# Altium schematic sheet ADCS Subsystem_AVR.SchDoc
size A1; SheetNumber: 1; SheetTotal: 1
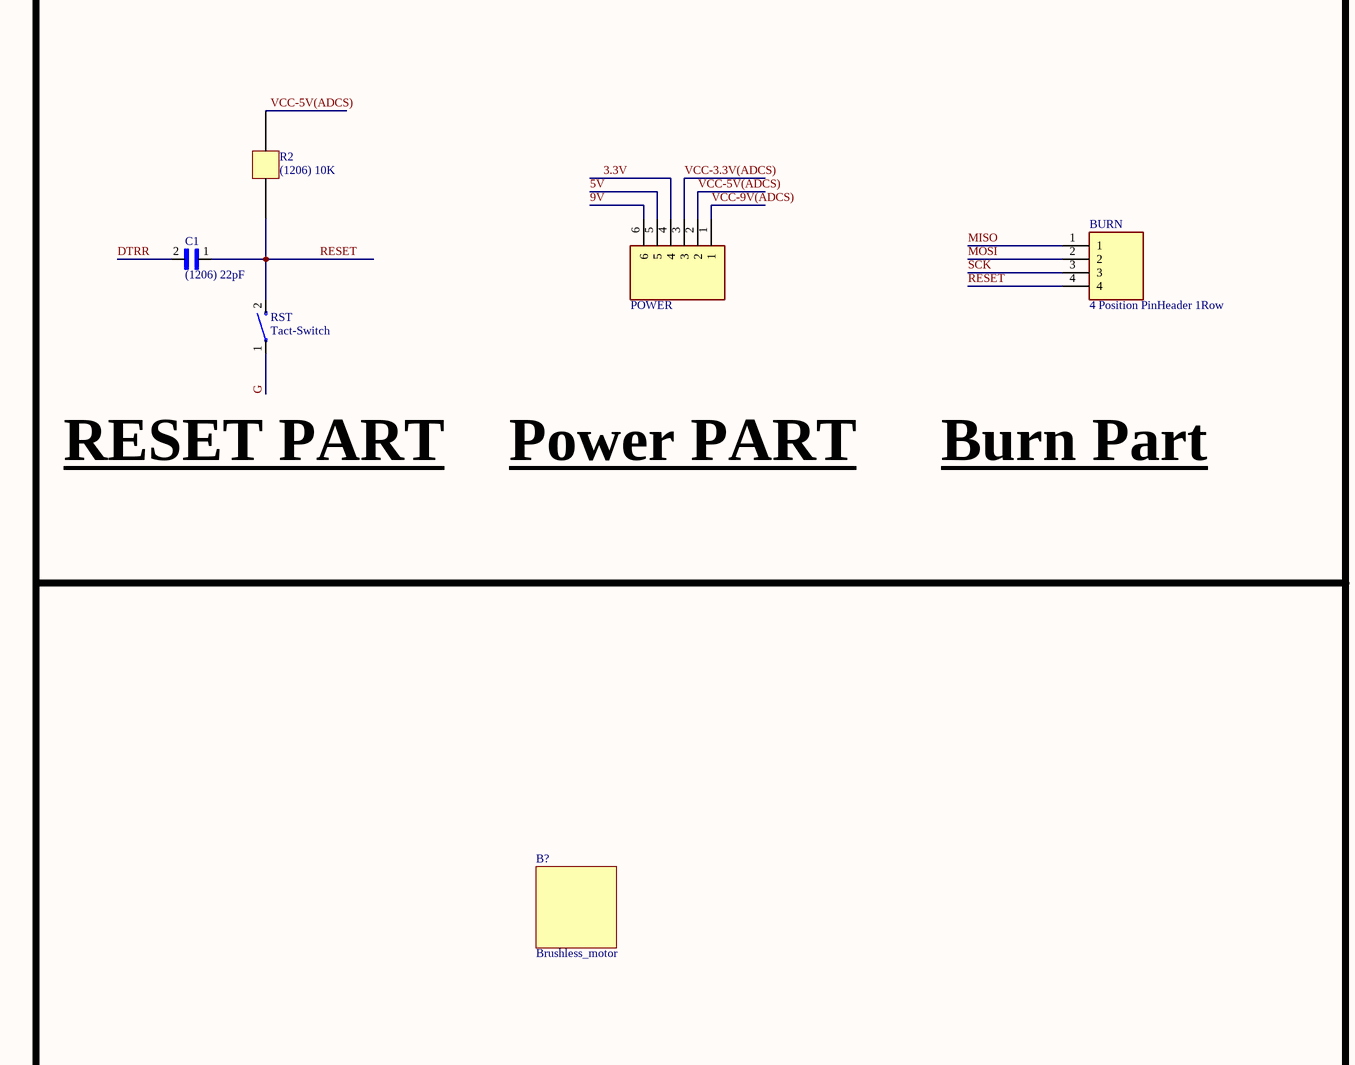
[diagram p0: ADCS Subsystem_AVR.SchDoc, top left]
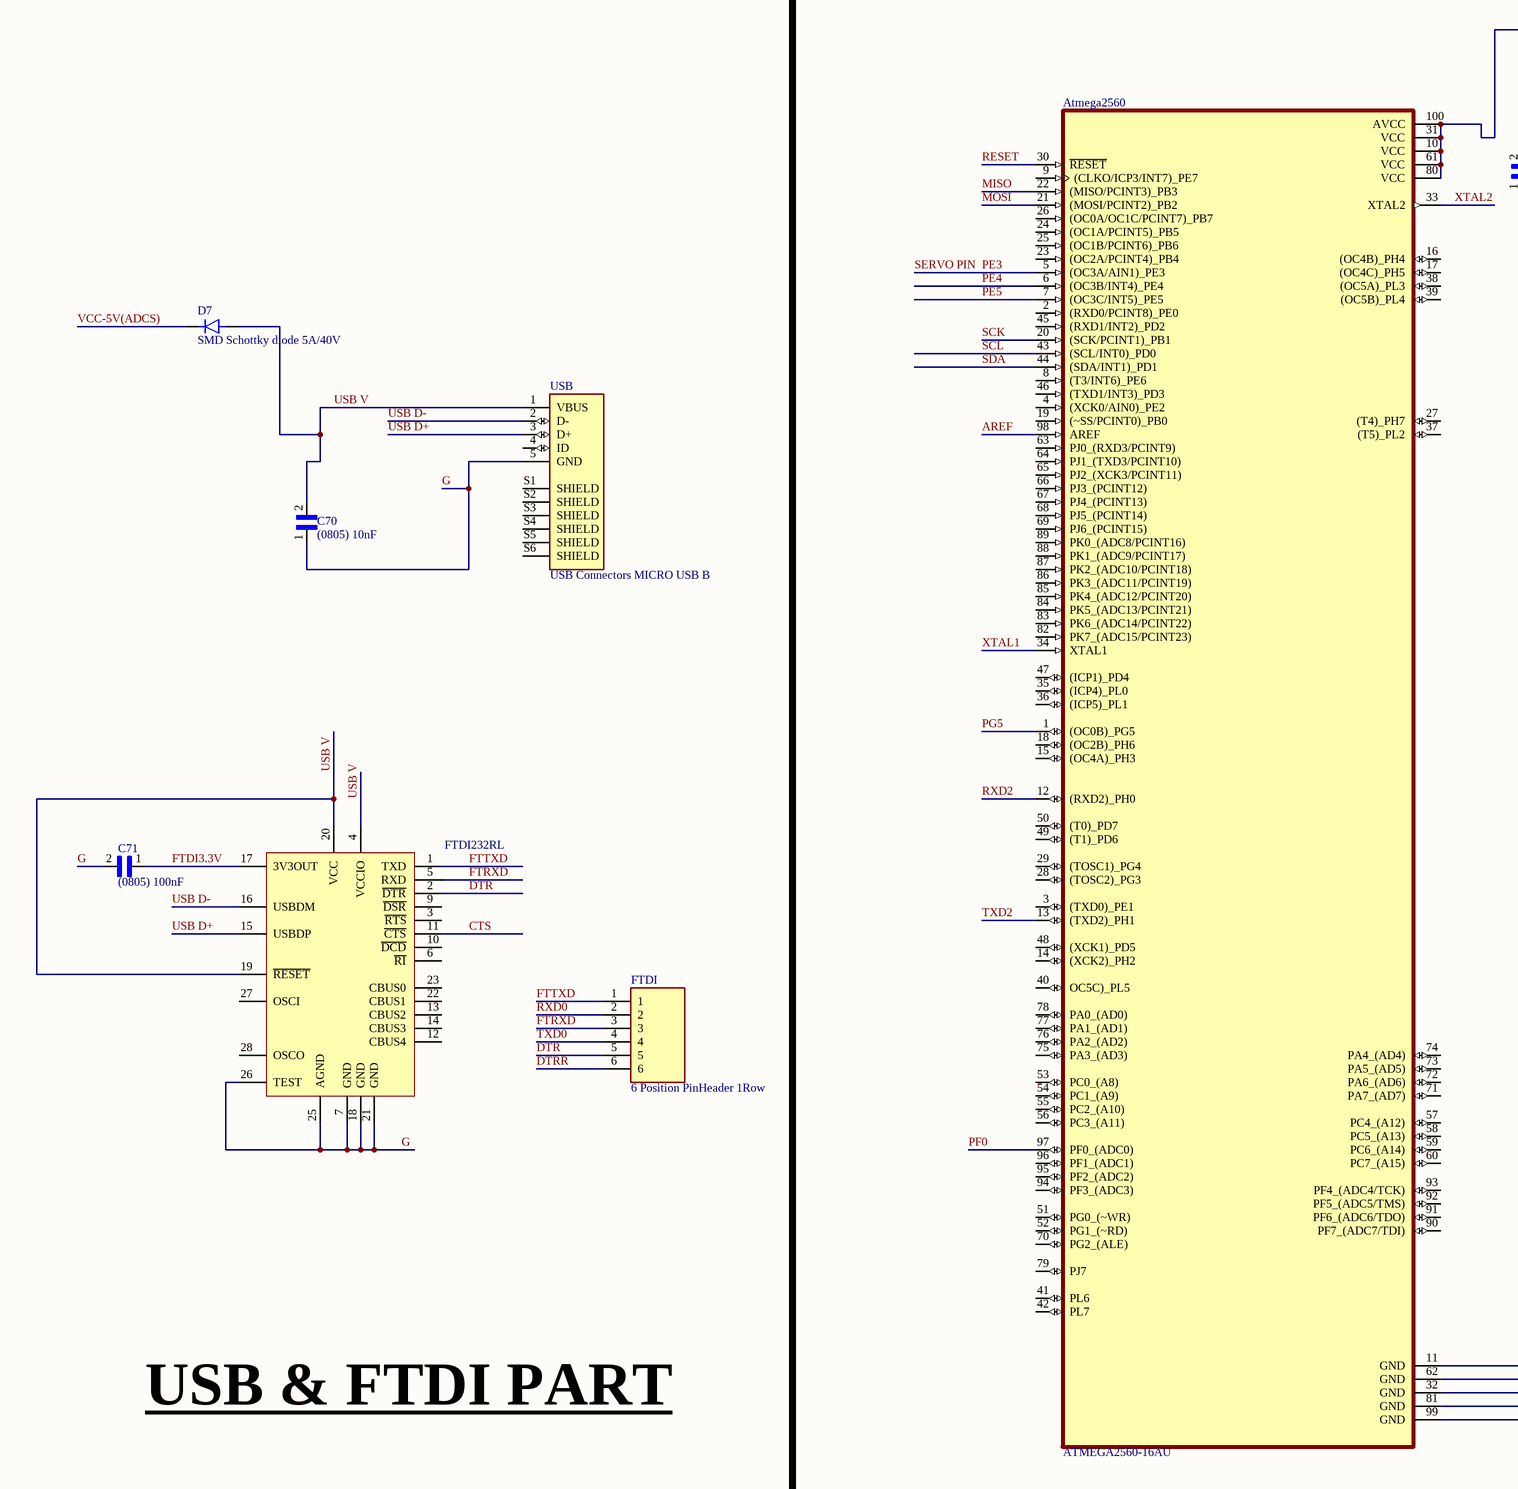
[diagram p1: ADCS Subsystem_AVR.SchDoc, top middle]
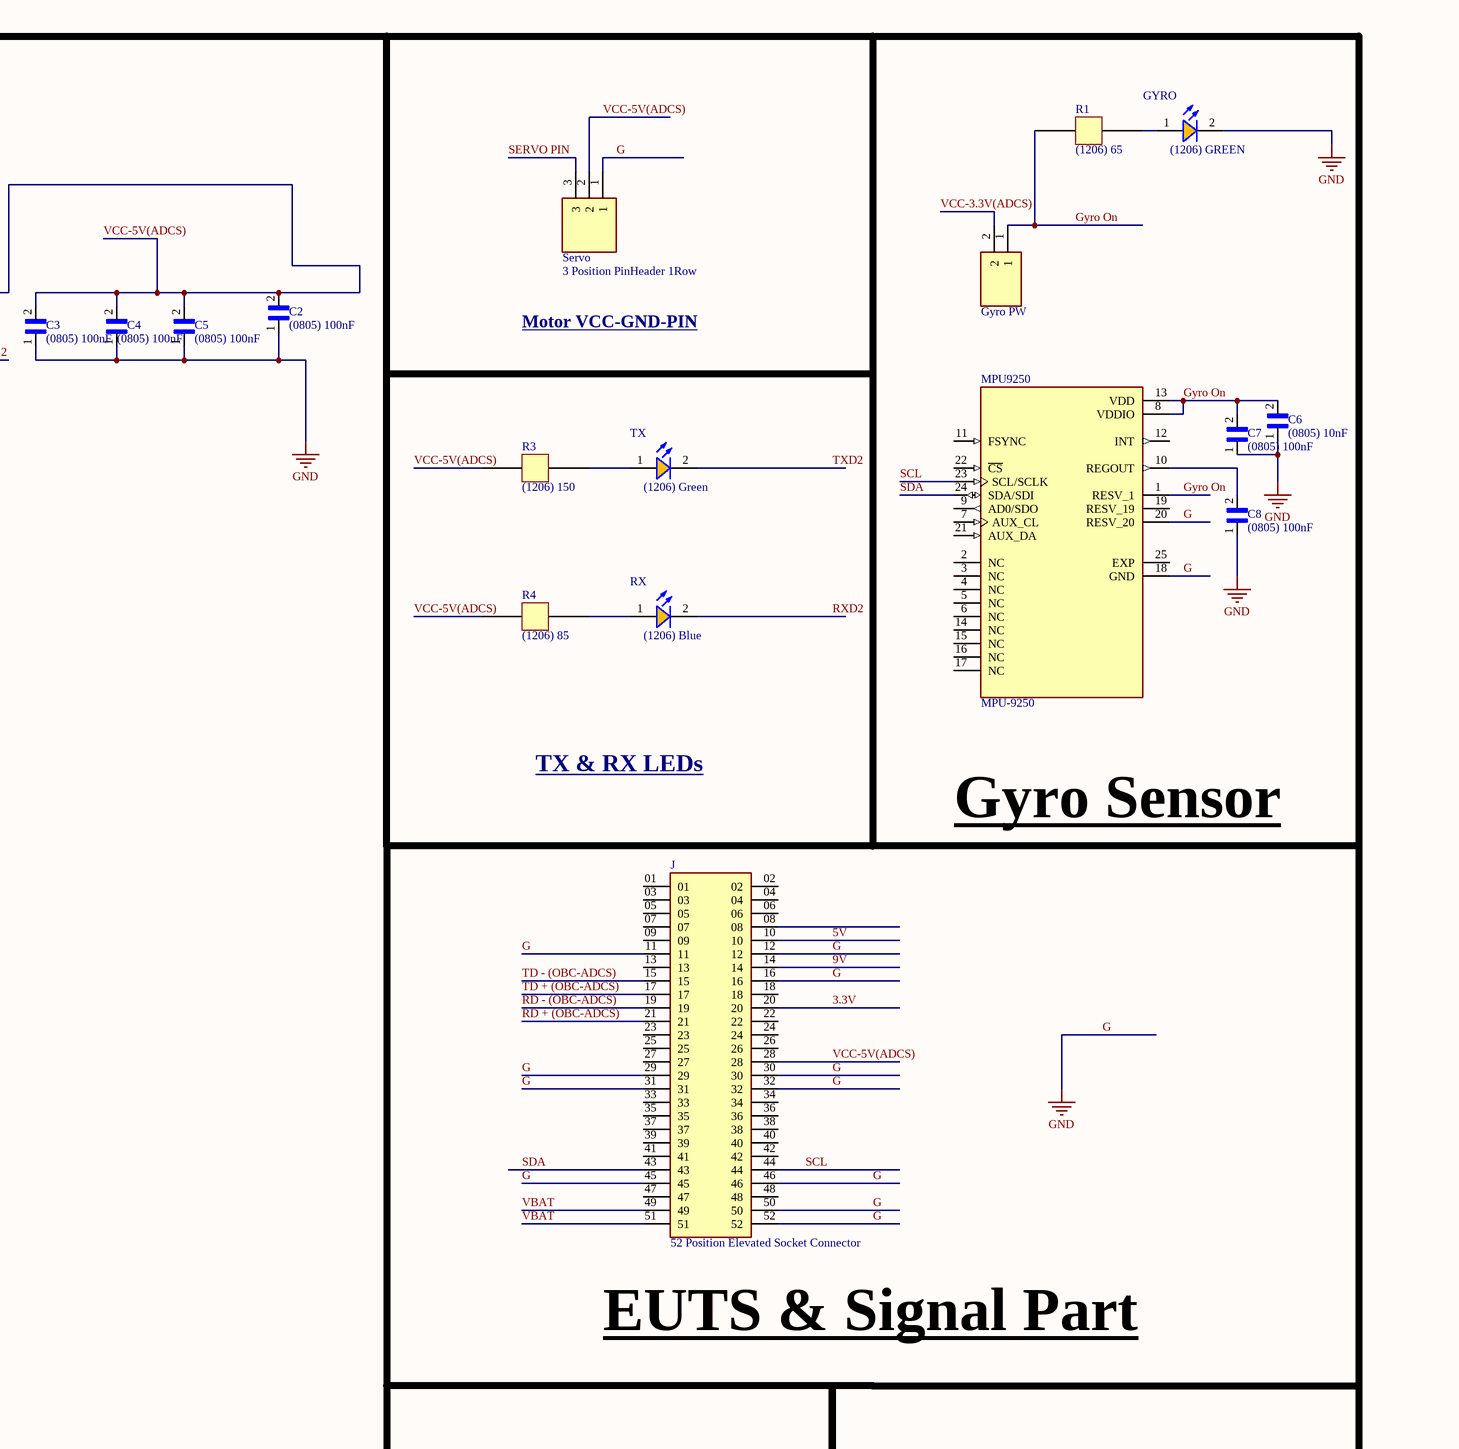
[diagram p2: ADCS Subsystem_AVR.SchDoc, top right]
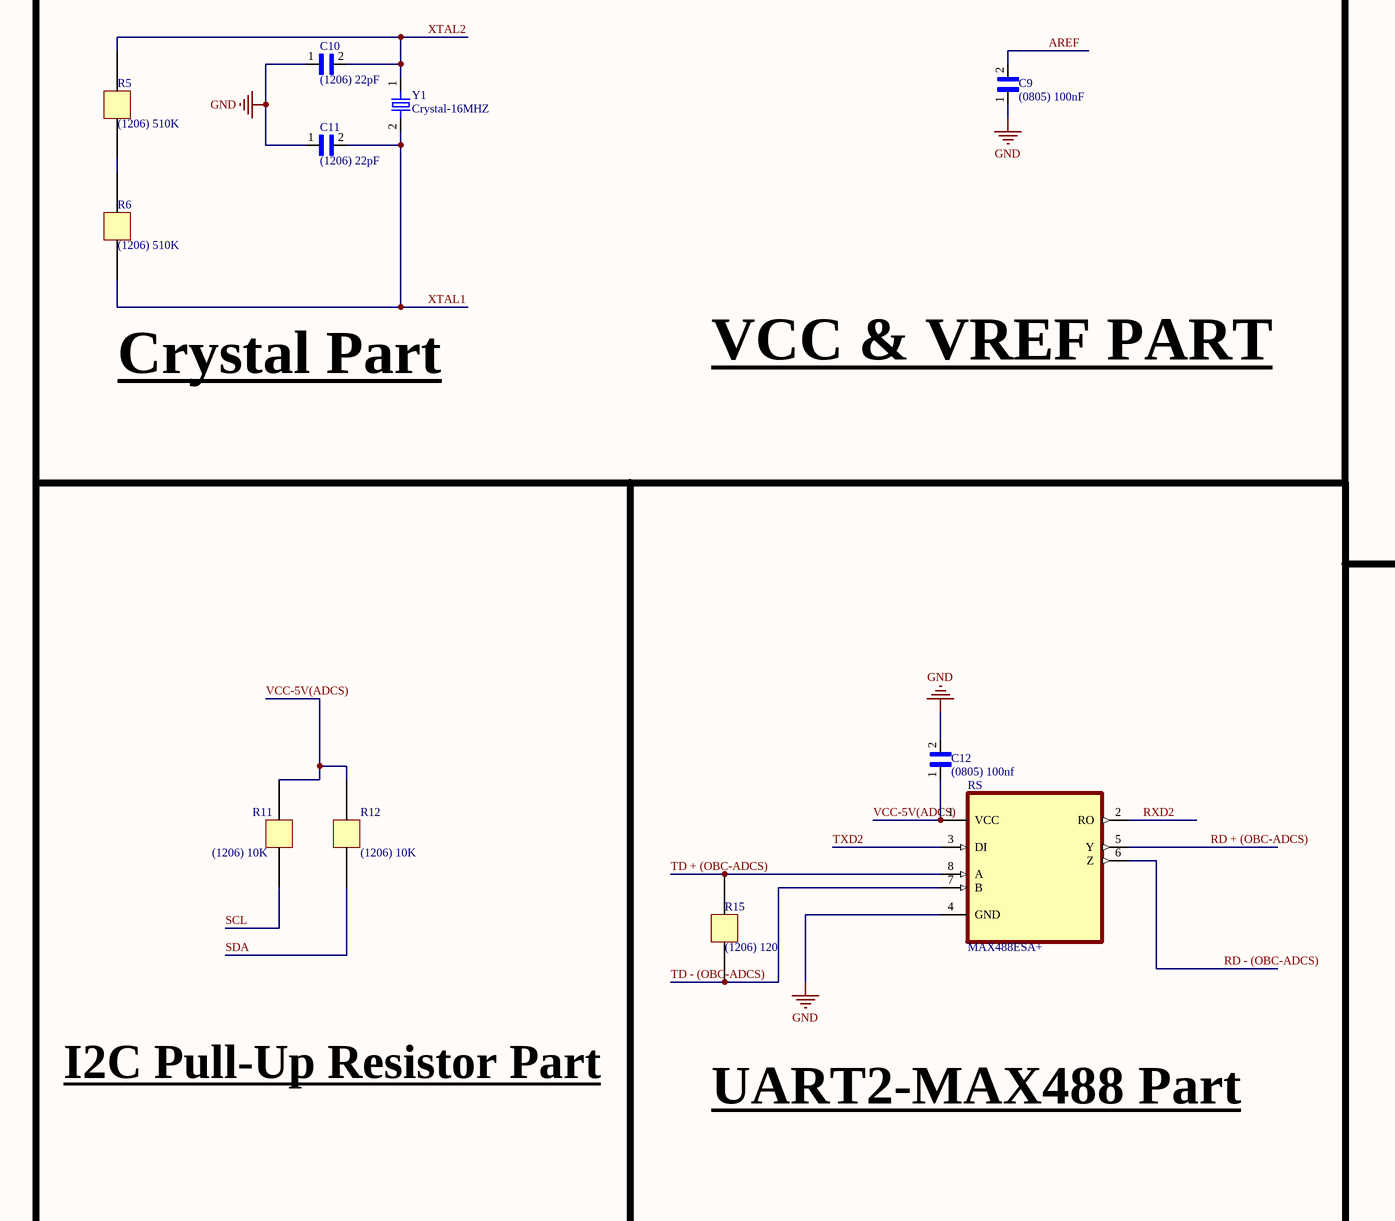
[diagram p3: ADCS Subsystem_AVR.SchDoc, bottom left]
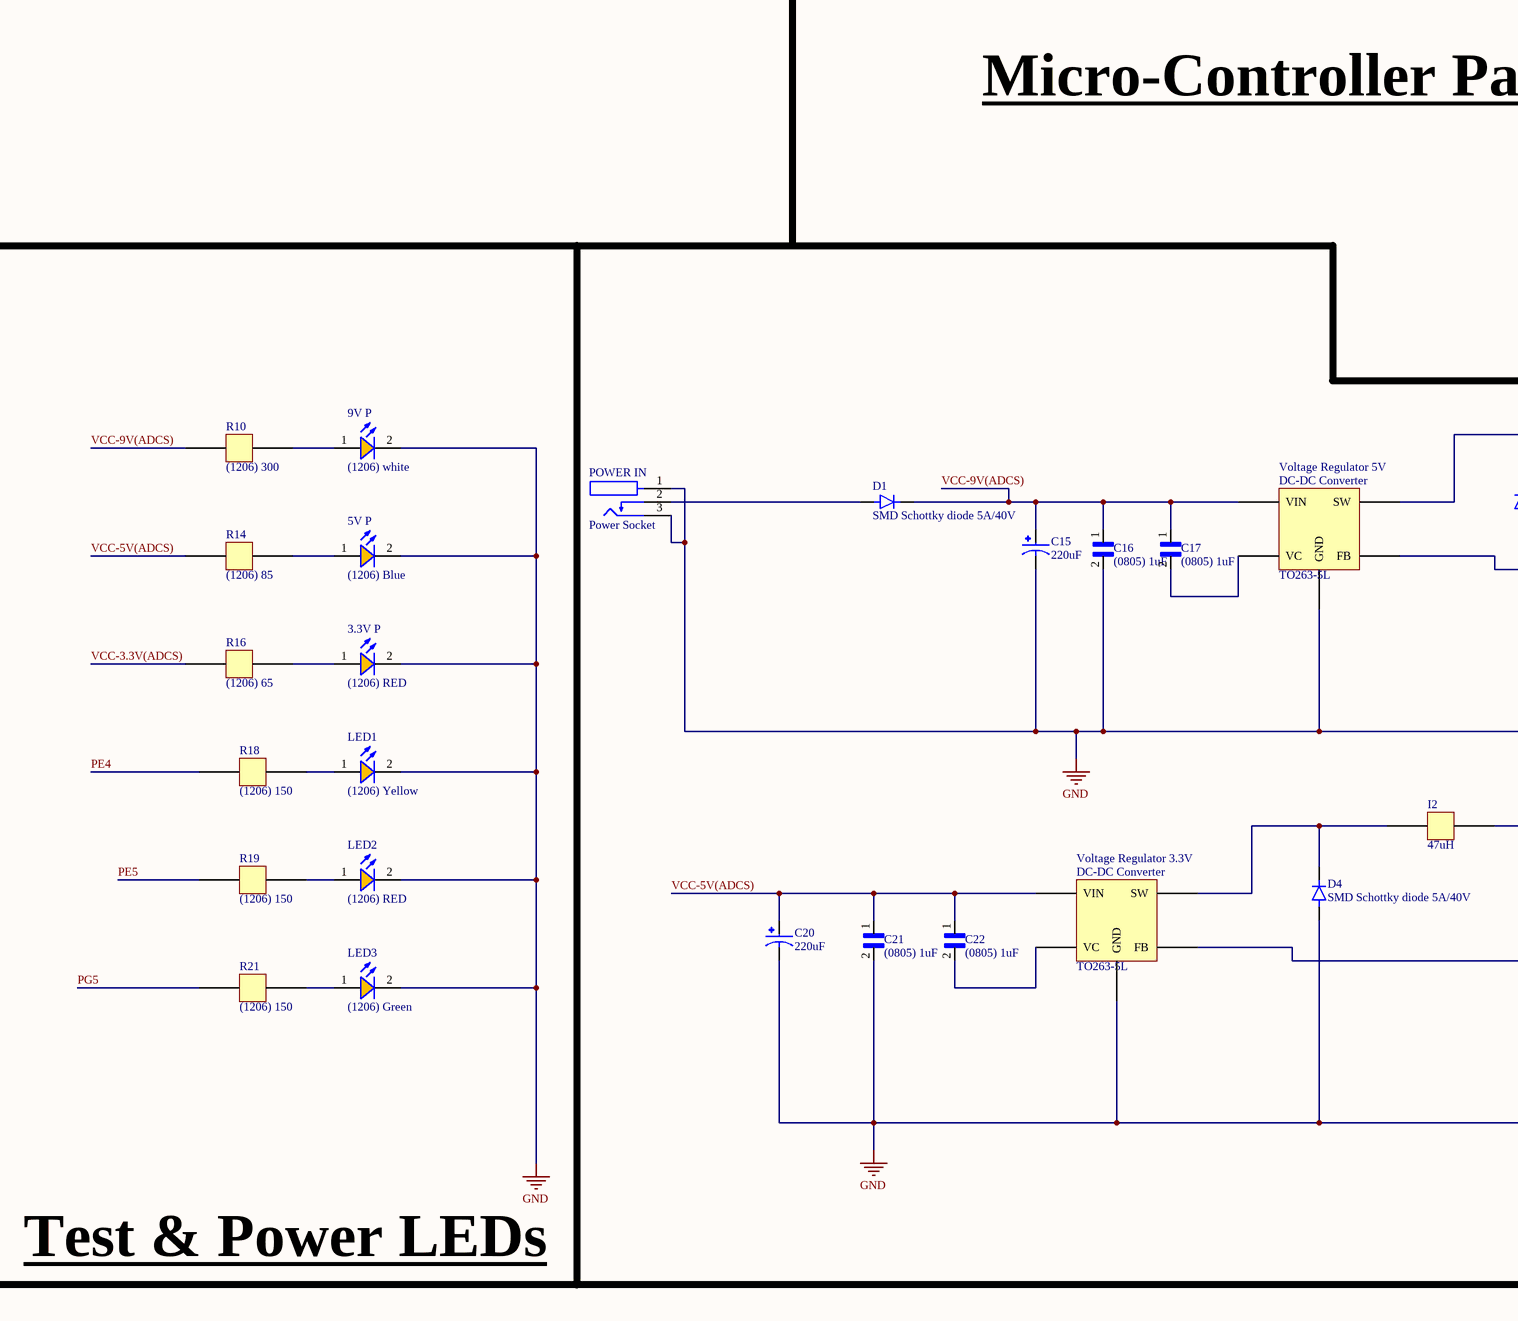
[diagram p4: ADCS Subsystem_AVR.SchDoc, bottom middle]
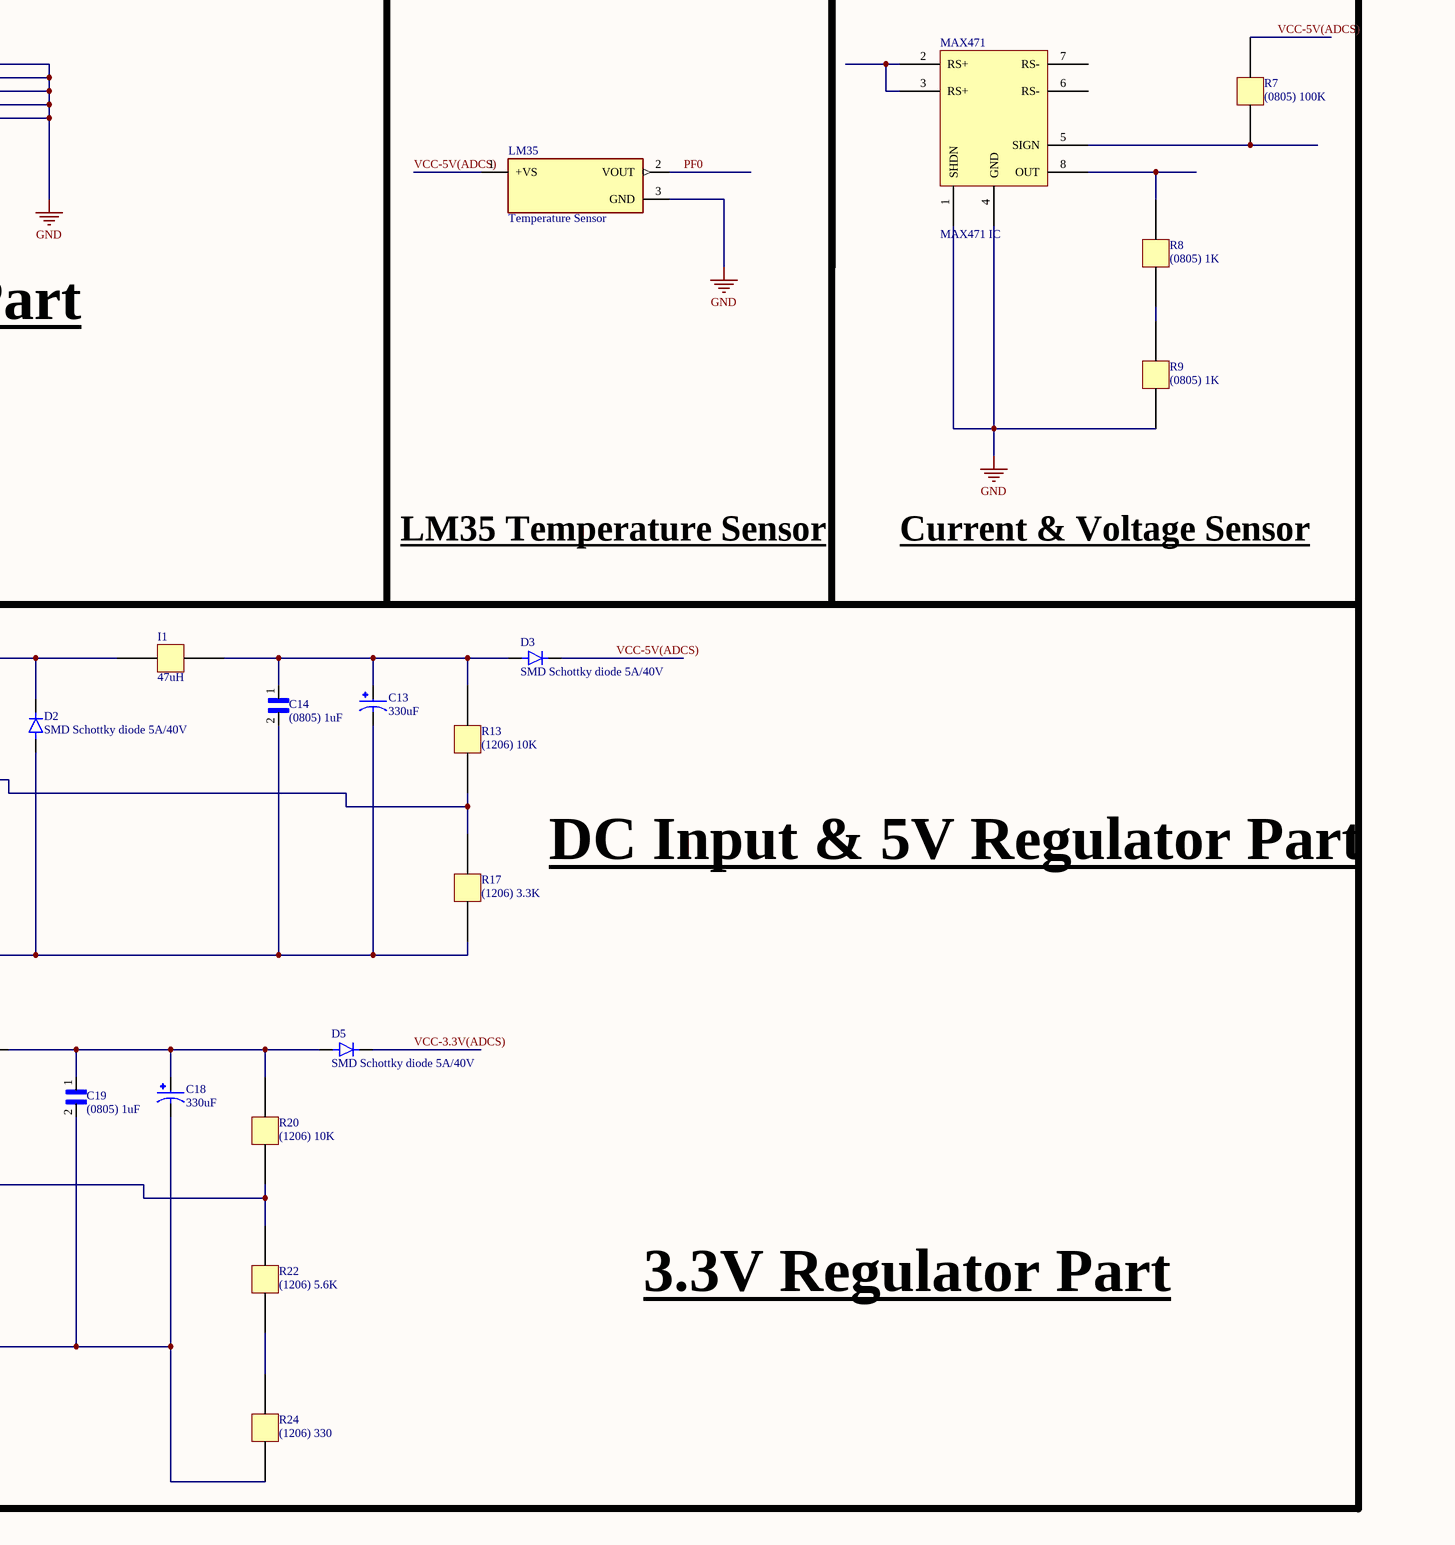
[diagram p5: ADCS Subsystem_AVR.SchDoc, bottom right]

## Parts
3.3V_P  (1206) RED  [RESC3015X65-01]
5V_P  (1206) Blue  [RESC3015X65-01]
9V_P  (1206) white  [RESC3015X65-01]
Atmega2560  ATMEGA2560-16AU  [QFP50P1600X1600X120-100N]
B?  Brushless_motor  [brushless_motor_2200KV]
BURN  4 Position PinHeader 1Row  [TE_3-644456-4]
C1  (1206) 22pF  [CAPC3216X125N0]
C2  (0805) 100nF  [CAPC2012X95N-0]
C3  (0805) 100nF  [CAPC2012X95N-0]
C4  (0805) 100nF  [CAPC2012X95N-0]
C5  (0805) 100nF  [CAPC2012X95N-0]
C6  (0805) 10nF  [CAPC2012X95N-0]
C7  (0805) 100nF  [CAPC2012X95N-0]
C8  (0805) 100nF  [CAPC2012X95N-0]
C9  (0805) 100nF  [CAPC2012X95N-0]
C10  (1206) 22pF  [CAPC3216X125N0]
C11  (1206) 22pF  [CAPC3216X125N0]
C12  (0805) 100nf  [CAPC2012X95N-0]
C13  330uF  [CAPPRD500W60D1250H2500]
C14  (0805) 1uF  [CAPC2012X95N-0]
C15  220uF  [CAPPRD500W60D1250H2500]
C16  (0805) 1uF  [CAPC2012X95N-0]
C17  (0805) 1uF  [CAPC2012X95N-0]
C18  330uF  [CAPPRD500W60D1250H2500]
C19  (0805) 1uF  [CAPC2012X95N-0]
C20  220uF  [CAPPRD500W60D1250H2500]
C21  (0805) 1uF  [CAPC2012X95N-0]
C22  (0805) 1uF  [CAPC2012X95N-0]
C70  (0805) 10nF  [CAPC2012X95N-0]
C71  (0805) 100nF  [CAPC2012X95N-0]
D1  SMD Schottky diode 5A/40V  [DIOM5227X270N]
D2  SMD Schottky diode 5A/40V  [DIOM5227X270N]
D3  SMD Schottky diode 5A/40V  [DIOM5227X270N]
D4  SMD Schottky diode 5A/40V  [DIOM5227X270N]
D5  SMD Schottky diode 5A/40V  [DIOM5227X270N]
D7  SMD Schottky diode 5A/40V  [DIOM5227X270N]
FTDI  6 Position PinHeader 1Row  [TE_6-146285-6]
FTDI232RL  IC_FT232RL  [SSOP-28]  (value not drawn)
GYRO  (1206) GREEN  [RESC3015X65-01]
Gyro_PW  2 Position PinHeader  [TE_2-103327-2]  (value not drawn)
I1  47uH  [IND]
I2  47uH  [IND]
J  52 Position Elevated Socket Connector  [SAMTEC_ESQ-126-39-G-D]
LED1  (1206) Yellow  [RESC3015X65-01]
LED2  (1206) RED  [RESC3015X65-01]
LED3  (1206) Green  [RESC3015X65-01]
LM35  Temperature Sensor  [TO92127P521H735-4]
MAX471  MAX471 IC  [SOIC127P600X168-8N]
MPU9250  MPU-9250  [QFN40P300X300X105-25N]
POWER  6 Position PinHeader 1Row  [TE_6-146285-6]  (value not drawn)
POWER_IN  Power Socket  [GRAVITECH_CON-SOCJ-2155]
R1  (1206) 65  [CAPC3216X125N0]
R2  (1206) 10K  [CAPC3216X125N0]
R3  (1206) 150  [CAPC3216X125N0]
R4  (1206) 85  [CAPC3216X125N0]
R5  (1206) 510K  [CAPC3216X125N0]
R6  (1206) 510K  [CAPC3216X125N0]
R7  (0805) 100K  [CAPC2012X95N-0]
R8  (0805) 1K  [CAPC2012X95N-0]
R9  (0805) 1K  [CAPC2012X95N-0]
R10  (1206) 300  [CAPC3216X125N0]
R11  (1206) 10K  [CAPC3216X125N0]
R12  (1206) 10K  [CAPC3216X125N0]
R13  (1206) 10K  [CAPC3216X125N0]
R14  (1206) 85  [CAPC3216X125N0]
R15  (1206) 120  [CAPC3216X125N0]
R16  (1206) 65  [CAPC3216X125N0]
R17  (1206) 3.3K  [CAPC3216X125N0]
R18  (1206) 150  [CAPC3216X125N0]
R19  (1206) 150  [CAPC3216X125N0]
R20  (1206) 10K  [CAPC3216X125N0]
R21  (1206) 150  [CAPC3216X125N0]
R22  (1206) 5.6K  [CAPC3216X125N0]
R24  (1206) 330  [CAPC3216X125N0]
RS  MAX488ESA+  [SOIC127P600X175-8N0]
RST  Tact-Switch  [Tact Switch]
RX  (1206) Blue  [RESC3015X65-01]
Servo  3 Position PinHeader 1Row  [TE_3-103327-3]
TX  (1206) Green  [RESC3015X65-01]
USB  USB Connectors MICRO USB B  [MOLEX_47346-0001]
Voltage_Regulator_3.3V  Voltage Regulator  [TO-263-5]  (value not drawn)
Voltage_Regulator_5V  Voltage Regulator  [TO-263-5]  (value not drawn)
Y1  Crystal-16MHZ  [XTAL1140X490X430N-0]

## Nets
G: 3.3V_P.2(K) 5V_P.2(K) 9V_P.2(K) Atmega2560.11(GND) Atmega2560.32(GND) Atmega2560.62(GND) Atmega2560.81(GND) Atmega2560.99(GND) C2.1 C3.1 C4.1 C5.1 C6.1 C7.1 C8.1 C9.1 C10.1 C11.1 C12.2 C13.N C14.2 C15.N C16.2 C18.N C19.2 C20.N C21.2 C70.1 C71.2 D2.A D4.A FTDI232RL.7(GND) FTDI232RL.18(GND) FTDI232RL.21(GND) FTDI232RL.25(AGND) FTDI232RL.26(TEST) GYRO.2(K) J.11 J.12 J.16 J.29 J.30 J.31 J.32 J.45 J.46 J.50 J.52 LED1.2(K) LED2.2(K) LED3.2(K) LM35.3(GND) MAX471.1(SHDN) MAX471.4(GND) MPU9250.18(GND) MPU9250.20(RESV_20) POWER_IN.1 POWER_IN.3 R9.1 R17.1 R24.1 RS.4(GND) RST.1 Servo.1 USB.5(GND) Voltage_Regulator_3.3V.1(GND) Voltage_Regulator_5V.1(GND)  [also labelled GND]
NC: FTDI232RL.8(NC) FTDI232RL.24(NC)
3.3V: J.20 POWER.4
5V: J.10 POWER.5
9V: J.14 POWER.6
AREF: Atmega2560.98(AREF) C9.2
CTS: FTDI232RL.11(~{CTS})
DTR: FTDI.5 FTDI232RL.2(~{DTR})
DTRR: C1.2 FTDI.6
FTDI3.3V: C71.1 FTDI232RL.17(3V3OUT)
FTRXD: FTDI.3 FTDI232RL.5(RXD)
FTTXD: FTDI.1 FTDI232RL.1(TXD)
Gyro On: C6.2 C7.2 Gyro_PW.1 MPU9250.1(RESV_1) MPU9250.8(VDDIO) MPU9250.13(VDD) R1.1
MISO: Atmega2560.22((MISO/PCINT3)_PB3) BURN.1
MOSI: Atmega2560.21((MOSI/PCINT2)_PB2) BURN.2
PE3: Atmega2560.5((OC3A/AIN1)_PE3) Servo.3  [also labelled SERVO PIN]
PE4: Atmega2560.6((OC3B/INT4)_PE4) R18.1
PE5: Atmega2560.7((OC3C/INT5)_PE5) R19.1
PF0: Atmega2560.97(PF0_(ADC0)) LM35.2(VOUT)
PG5: Atmega2560.1((OC0B)_PG5) R21.1
RD + (OBC-ADCS): J.21 RS.5(Y)
RD - (OBC-ADCS): J.19 RS.6(Z)
RESET: Atmega2560.30(~{RESET}) BURN.4 C1.1 R2.2 RST.2
RXD0: FTDI.2
RXD2: Atmega2560.12((RXD2)_PH0) RS.2(RO) RX.2(K)
SCK: Atmega2560.20((SCK/PCINT1)_PB1) BURN.3
SCL: Atmega2560.43((SCL/INT0)_PD0) J.44 MPU9250.23(SCL/SCLK) R11.2
SDA: Atmega2560.44((SDA/INT1)_PD1) J.43 MPU9250.24(SDA/SDI) R12.2
TD + (OBC-ADCS): J.17 R15.2 RS.8(A)
TD - (OBC-ADCS): J.15 R15.1 RS.7(B)
TXD0: FTDI.4
TXD2: Atmega2560.13((TXD2)_PH1) RS.3(DI) TX.2(K)
USB D+: FTDI232RL.15(USBDP) USB.3(D+)
USB D-: FTDI232RL.16(USBDM) USB.2(D-)
USB V: C70.2 D7.A FTDI232RL.4(VCCIO) FTDI232RL.19(~{RESET}) FTDI232RL.20(VCC) USB.1(VBUS)
VBAT: J.49 J.51
VCC-3.3V(ADCS): D5.C(K) Gyro_PW.2 POWER.3 R16.1
VCC-5V(ADCS): Atmega2560.10(VCC) Atmega2560.31(VCC) Atmega2560.61(VCC) Atmega2560.80(VCC) Atmega2560.100(AVCC) C2.2 C3.2 C4.2 C5.2 C12.1 C20.P C21.1 C22.1 D3.C(K) D7.C(K) J.28 LM35.1(+VS) POWER.2 R2.1 R3.1 R4.1 R7.2 R11.1 R12.1 R14.1 RS.1(VCC) Servo.2 Voltage_Regulator_3.3V.5(VIN)
VCC-9V(ADCS): C15.P C16.1 C17.1 D1.C(K) POWER.1 R10.1 Voltage_Regulator_5V.5(VIN)
XTAL1: Atmega2560.34(XTAL1) C11.2 R6.1 Y1.2
XTAL2: Atmega2560.33(XTAL2) C10.2 R5.2 Y1.1
Net3.3V_P_1: 3.3V_P.1(A) R16.2
Net5V_P_1: 5V_P.1(A) R14.2
Net9V_P_1: 9V_P.1(A) R10.2
NetC8_2: C8.2 MPU9250.10(REGOUT)
NetC13_P: C13.P C14.1 D3.A I1.2 R13.2
NetC17_2: C17.2 Voltage_Regulator_5V.4(VC)
NetC18_P: C18.P C19.1 D5.A I2.2 R20.2
NetC22_2: C22.2 Voltage_Regulator_3.3V.4(VC)
NetD1_A: D1.A POWER_IN.2
NetD2_C: D2.C(K) I1.1 Voltage_Regulator_5V.3(SW)
NetD4_C: D4.C(K) I2.1 Voltage_Regulator_3.3V.3(SW)
NetGYRO_1: GYRO.1(A) R1.2
NetLED1_1: LED1.1(A) R18.2
NetLED2_1: LED2.1(A) R19.2
NetLED3_1: LED3.1(A) R21.2
NetMAX471_2: MAX471.2(RS+) MAX471.3(RS+)
NetMAX471_5: MAX471.5(SIGN) R7.1
NetMAX471_8: MAX471.8(OUT) R8.2
NetR3_2: R3.2 TX.1(A)
NetR4_2: R4.2 RX.1(A)
NetR5_1: R5.1 R6.2
NetR8_1: R8.1 R9.2
NetR13_1: R13.1 R17.2 Voltage_Regulator_5V.2(FB)
NetR20_1: R20.1 R22.2 Voltage_Regulator_3.3V.2(FB)
NetR22_1: R22.1 R24.2

Not connected (* = marked no-connect by the designer): Atmega2560 2((RXD0/PCINT8)_PE0) 3((TXD0)_PE1) 4((XCK0/AIN0)_PE2) 8((T3/INT6)_PE6) 9((CLKO/ICP3/INT7)_PE7) 14((XCK2)_PH2) 15((OC4A)_PH3) 16((OC4B)_PH4) 17((OC4C)_PH5) 18((OC2B)_PH6) 19((~SS/PCINT0)_PB0) 23((OC2A/PCINT4)_PB4) 24((OC1A/PCINT5)_PB5) 25((OC1B/PCINT6)_PB6) 26((OC0A/OC1C/PCINT7)_PB7) 27((T4)_PH7) 28((TOSC2)_PG3) 29((TOSC1)_PG4) 35((ICP4)_PL0) 36((ICP5)_PL1) 37((T5)_PL2) 38((OC5A)_PL3) 39((OC5B)_PL4) 40(OC5C)_PL5) 41(PL6) 42(PL7) 45((RXD1/INT2)_PD2) 46((TXD1/INT3)_PD3) 47((ICP1)_PD4) 48((XCK1)_PD5) 49((T1)_PD6) 50((T0)_PD7) 51(PG0_(~WR)) 52(PG1_(~RD)) 53(PC0_(A8)) 54(PC1_(A9)) 55(PC2_(A10)) 56(PC3_(A11)) 57(PC4_(A12)) 58(PC5_(A13)) 59(PC6_(A14)) 60(PC7_(A15)) 63(PJ0_(RXD3/PCINT9)) 64(PJ1_(TXD3/PCINT10)) 65(PJ2_(XCK3/PCINT11)) 66(PJ3_(PCINT12)) 67(PJ4_(PCINT13)) 68(PJ5_(PCINT14)) 69(PJ6_(PCINT15)) 70(PG2_(ALE)) 71(PA7_(AD7)) 72(PA6_(AD6)) 73(PA5_(AD5)) 74(PA4_(AD4)) 75(PA3_(AD3)) 76(PA2_(AD2)) 77(PA1_(AD1)) 78(PA0_(AD0)) 79(PJ7) 82(PK7_(ADC15/PCINT23)) 83(PK6_(ADC14/PCINT22)) 84(PK5_(ADC13/PCINT21)) 85(PK4_(ADC12/PCINT20)) 86(PK3_(ADC11/PCINT19)) 87(PK2_(ADC10/PCINT18)) 88(PK1_(ADC9/PCINT17)) 89(PK0_(ADC8/PCINT16)) 90(PF7_(ADC7/TDI)) 91(PF6_(ADC6/TDO)) 92(PF5_(ADC5/TMS)) 93(PF4_(ADC4/TCK)) 94(PF3_(ADC3)) 95(PF2_(ADC2)) 96(PF1_(ADC1)); FTDI232RL 3(~{RTS}) 6(~{RI}) 9(~{DSR}) 10(~{DCD}) 12(CBUS4) 13(CBUS2) 14(CBUS3) 22(CBUS1) 23(CBUS0) 27(OSCI) 28(OSCO); J 01 02 03 04 05 06 07 08 09 13 18 22 23 24 25 26 27 33 34 35 36 37 38 39 40 41 42 47 48; MAX471 6(RS-) 7(RS-); MPU9250 2(NC) 3(NC) 4(NC) 5(NC) 6(NC) 7(AUX_CL) 9(AD0/SDO) 11(FSYNC) 12(INT) 14(NC) 15(NC) 16(NC) 17(NC) 19(RESV_19) 21(AUX_DA) 22(~{CS}) 25(EXP); USB 4(ID) S1(SHIELD) S2(SHIELD) S3(SHIELD) S4(SHIELD) S5(SHIELD) S6(SHIELD)

## Notes on the sheet
- Motor VCC-GND-PIN
- RESET PART
- Power PART
- Burn Part
- TX & RX LEDs
- Gyro Sensor
- EUTS & Signal Part
- USB & FTDI PART
- Crystal Part
- VCC & VREF PART
- Micro-Controller Part
- LM35 Temperature Sensor
- Current & Voltage Sensor
- DC Input & 5V Regulator Part
- I2C Pull-Up Resistor Part
- UART2-MAX488 Part
- 3.3V Regulator Part
- Test & Power LEDs
- (in symbol Voltage Regulator) DC-DC Converter; TO263-5L

## Library data of the parts
3.3V_P 5V_P 9V_P GYRO LED1-LED3 RX TX = LED 1206: LED SMD 1206 High Quality Forward Voltage: 3.2 V / Brightness: 700 mcd; Manufacturer: Wurth Elektronik; Manufacturer Part Number: 150060AS75003; Chip Technology: AlInGaP; Dominant Wavelength: 605nm; Emitting Color: Amber; Forward Voltage: 2V; Luminous Intensity: 350mcd; Peak Wavelength: 610nm; Viewing Angle: 140°; ComponentLink1Description: Manufacturer Link; ComponentLink1URL: http://www.we-online.de; ComponentLink2Description: Datasheet; ComponentLink2URL: https://www.we-online.com/catalog/datasheet/150060AS75003.pdf; Height: 0.7mm; Length: 1.6mm; Mounting Technology: SMT; Operating Temperature max.: 100C; Operating Temperature min.: -40C; Packaging: Tape and Reel; Size: 0603; Width: 0.8mm
BURN = 4 Position PinHeader 1Row: Conn Unshrouded Header HDR 4 POS 2.54mm Solder ST Thru-Hole Bag/Box; MP: 3-644456-4; Number_of_Positions: 4; Product_Type: Connector; MF: TE Connectivity; Centerline_Pitch: 2.54 mm[.1 in]; Package: None; Availability: Warning; EU_RoHS_Compliance: Compliant; SnapEDA_Link: https://www.snapeda.com/parts/3-644456-4/TE%20Connectivity%20AMP%20Connectors/view-part/482664/?ref=snap; DigiKey-Purchase-URL: https://snapeda.com/shop?store=DigiKey&id=482664; Mouser-Purchase-URL: https://snapeda.com/shop?store=Mouser&id=482664; Price: None; Value: *
C1 C10 C11 = Capacitor 1206: UMF316B7103KFHT/1206 Capacitor; Package: None; Price: None; Value: *; MP: UMF316B7103KFHT; Availability: Unavailable
C2-C9 C12 C14 C16 C17 C19 C21 C22 C70 C71 = Capacitor 0805: UMK212SD103KD-T/CAP CER 10000PF 50V 0805; Package: None; Price: None; Value: *; MP: UMK212SD103KD-T; Availability: Unavailable
C13 C15 C18 C20 = Aluminum Electrolytic Capacitor: Aluminum Electrolytic Capacitors - Radial Leaded 47uF 250volts AEC-Q200; MP: EEUEB2E470B; MF: Panasonic; Availability: In Stock; SnapEDA_Link: https://www.snapeda.com/parts/EEUEB2E470B/Panasonic/view-part/?ref=snap; Value: *; Price: None; Package: RADIAL-2 Panasonic; Check_prices: https://www.snapeda.com/parts/EEUEB2E470B/Panasonic/view-part/?ref=eda
D1-D5 D7 = SMD Schottky diode 5A/40V: S1 Series 1000 V 1 A 1 uA Surface Mount General Purpose Rectifier - DO-214AC; MP: S1M; Price: None; Value: *; Availability: Unavailable; Package: None
FTDI POWER = 6 Position PinHeader 1Row: Connector Header Through Hole 6 position 0.100 (2.54mm); MP: 5-146285-6; MF: TE Connectivity; DigiKey-Purchase-URL: https://snapeda.com/shop?store=DigiKey&id=2411669; EU_RoHS_Compliance: Compliant; Package: None; Value: *; SnapEDA_Link: https://www.snapeda.com/parts/5-146285-6/TE%20Connectivity%20AMP%20Connectors/view-part/2411669/?ref=snap; Digi-Key_Part_Number: A122872-ND
FTDI232RL = IC_FT232RL: FT232R USB UART; Manufacturer: *; Note: *; ManufacturerPartNo: *
Gyro_PW = 2 Position PinHeader: Cabezal del conector Agujero pasante 2 posiciones 0,100 (2,54 mm); MP: 4-103327-4; MF: TE Connectivity; SnapEDA_Link: https://www.snapeda.com/parts/4-103327-4/TE%20Connectivity%20AMP%20Connectors/view-part/2403998/?ref=snap; Purchase-URL: https://pricing.snapeda.com/search/part/4-103327-4/?ref=eda; Value: *; Package: None; EU_RoHS_Compliance: Compliant; Price: None; Availability: Warning; Check_prices: https://www.snapeda.com/parts/4-103327-4/TE%20Connectivity%20AMP%20Connectors/view-part/2403998/?ref=eda
I1 I2 = Inductor DIP
J = 52 Position Elevated Socket Connector: ESQ-126-39-G-D/52 Position Elevated Socket Connector Through Hole; MF: Samtec; Package: None; MP: ESQ-126-39-G-D; Value: *; Availability: Unavailable; Price: None; SnapEDA_Link: https://www.snapeda.com/parts/ESQ-126-39-G-D/Samtec%20Inc./view-part/490181/?ref=snap
LM35 = LM35DZ/NOPB/Temperature Sensor: LM35DZ/NOPB/Temperature Sensor Analog, Local 0Â°C ~ 100Â°C 10mV/Â°C TO-92-3; MF: Texas Instruments; MP: LM35DZ; Value: *; SnapEDA_Link: https://www.snapeda.com/parts/LM35DZ/Texas+Instruments/view-part/?ref=snap; Price: None; Availability: Not in stock; Package: E-PKG AXIAL-LEADED-2 ON Semiconductor; Check_prices: https://www.snapeda.com/parts/LM35DZ/Texas+Instruments/view-part/?ref=eda
MPU9250 = MPU-9250: MPU-9250 series Accelerometer, Gyroscope, Humidity, Magnetometer, Pressure, Temperature Sensor Evaluation Board; MF: TDK InvenSense; Package: TFQFN-24 TDK InvenSense; Purchase-URL: https://pricing.snapeda.com/search/part/MPU-9250/?ref=eda; Value: *; Price: None; Check_prices: https://www.snapeda.com/parts/MPU-9250/TDK+InvenSense/view-part/?ref=eda; MP: MPU-9250; SnapEDA_Link: https://www.snapeda.com/parts/MPU-9250/TDK+InvenSense/view-part/?ref=snap; Availability: In Stock
POWER_IN = Power Socket: CON-SOCJ-2155\DC Power Connectors Power Jack/Connector 2.1mm x 5.5mm; Price: None; Package: None; Availability: Unavailable; MP: CON-SOCJ-2155; Value: *
R1-R6 R10-R22 R24 = Resistor 1206
R7-R9 = Resistor 0805
RS = MAX488ESA+: 1/1 Transceiver Full RS422, RS485 8-SOIC; MP: MAX488ESA+T; MF: Maxim Integrated; Price: None; Package: SOIC-8 Maxim; Availability: Unavailable; SnapEDA_Link: https://www.snapeda.com/parts/MAX488ESA+T/Maxim%20Integrated/view-part/48834/?ref=snap; Value: *
RST = Tact-Switch: High Quality 3x6x2.7 mm SMD White Push Button Switch (Tact Switch); MP: 1437566-3; Price: None; Value: *; Package: None; Availability: Unavailable
Servo = 3 Position PinHeader 1Row: Conn Unshrouded Header HDR 3 POS 2.54mm Solder ST Thru-Hole Carton; MF: TE Connectivity; MP: 4-103327-5; Package: None; Value: *; TE_purchase_URL: https://www.te.com/usa-en/product-4-103327-5.html?te_bu=Cor&te_type=disp&te_campaign=seda_glo_cor-seda-global-disp-prtnr-fy19-seda-model-bom-cta_sma-317_1&elqCampaignId=32493; Price: None; SnapEDA_Link: https://www.snapeda.com/parts/4-103327-5/TE%20Connectivity%20AMP%20Connectors/view-part/2403997/?ref=snap; Availability: Unavailable; EU_RoHS_Compliance: Compliant
USB = USB Connectors MICRO USB B: USB Connectors MICRO USB B RECPT BTTM MOUNT ASSY; MP: 47346-0001; MF: Molex; Package: None; Purchase-URL: https://pricing.snapeda.com/search/part/47346-0001/?ref=eda; Check_prices: https://www.snapeda.com/parts/47346-0001/Molex/view-part/53503/?ref=eda; Value: *; Availability: Warning; Price: None; SnapEDA_Link: https://www.snapeda.com/parts/47346-0001/Molex/view-part/53503/?ref=snap
Voltage_Regulator_3.3V Voltage_Regulator_5V = Voltage Regulator: TO-263-5/XL4015E1 5A 75W Adjustable DC/DC STEP DOWN CONVERTER Regulator IC SMD
Atmega2560 = ATMEGA2560-16AU: Value: *; MP: ATMEGA2560-16AU; Package: None; Availability: Unavailable; Price: None